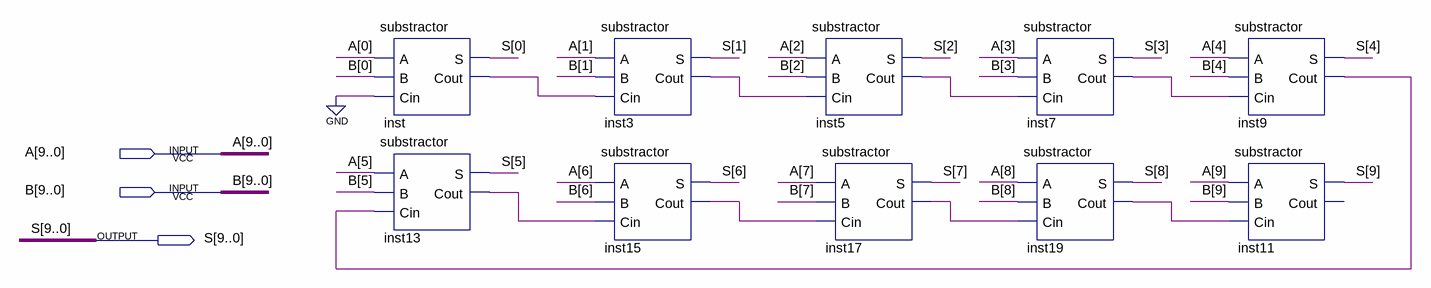
[diagram p0: schematic sheet]
// Quartus schematic substractor_10bit.bdf as structural Verilog: 10 symbols, 3 pins
module substractor_10bit (
  input  [9:0] A,
  input  [9:0] B,
  output [9:0] S
);

  wire inst3_cout, inst5_cout, inst7_cout, inst9_cout, inst13_cout, inst15_cout, inst17_cout, inst19_cout,
       inst_cout;

  substractor inst (.A(A[0]), .B(B[0]), .Cin(1'b0), .S(S[0]), .Cout(inst_cout));
  substractor inst13 (.A(A[5]), .B(B[5]), .Cin(inst9_cout), .S(S[5]), .Cout(inst13_cout));
  substractor inst3 (.A(A[1]), .B(B[1]), .Cin(inst_cout), .S(S[1]), .Cout(inst3_cout));
  substractor inst15 (.A(A[6]), .B(B[6]), .Cin(inst13_cout), .S(S[6]), .Cout(inst15_cout));
  substractor inst5 (.A(A[2]), .B(B[2]), .Cin(inst3_cout), .S(S[2]), .Cout(inst5_cout));
  substractor inst17 (.A(A[7]), .B(B[7]), .Cin(inst15_cout), .S(S[7]), .Cout(inst17_cout));
  substractor inst7 (.A(A[3]), .B(B[3]), .Cin(inst5_cout), .S(S[3]), .Cout(inst7_cout));
  substractor inst19 (.A(A[8]), .B(B[8]), .Cin(inst17_cout), .S(S[8]), .Cout(inst19_cout));
  substractor inst9 (.A(A[4]), .B(B[4]), .Cin(inst7_cout), .S(S[4]), .Cout(inst9_cout));
  substractor inst11 (.A(A[9]), .B(B[9]), .Cin(inst19_cout), .S(S[9]));  // open: Cout
endmodule
